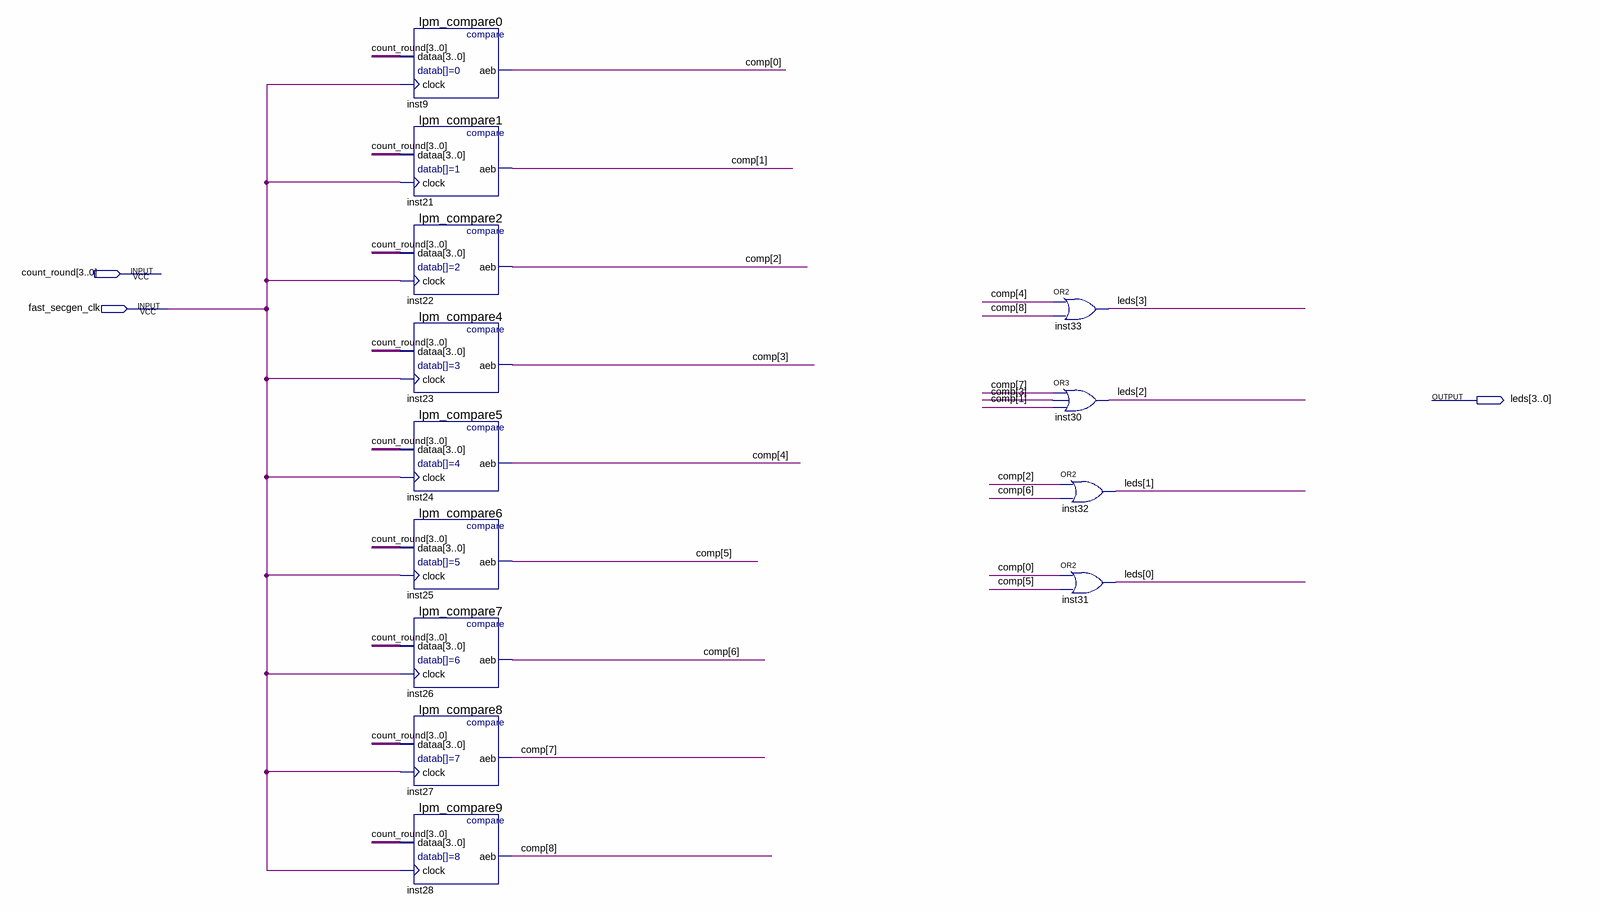
[diagram p0: schematic sheet]
// Quartus schematic leds_output.bdf as structural Verilog: 13 symbols, 3 pins
module leds_output (
  input  [3:0] count_round,
  input  fast_secgen_clk,
  output [3:0] leds
);

  wire [8:0] comp;

  lpm_compare0 inst9 (.dataa(count_round), .clock(fast_secgen_clk), .aeb(comp[0]));
  lpm_compare1 inst21 (.dataa(count_round), .clock(fast_secgen_clk), .aeb(comp[1]));
  lpm_compare2 inst22 (.dataa(count_round), .clock(fast_secgen_clk), .aeb(comp[2]));
  lpm_compare4 inst23 (.dataa(count_round), .clock(fast_secgen_clk), .aeb(comp[3]));
  lpm_compare5 inst24 (.dataa(count_round), .clock(fast_secgen_clk), .aeb(comp[4]));
  lpm_compare6 inst25 (.dataa(count_round), .clock(fast_secgen_clk), .aeb(comp[5]));
  lpm_compare7 inst26 (.dataa(count_round), .clock(fast_secgen_clk), .aeb(comp[6]));
  lpm_compare8 inst27 (.dataa(count_round), .clock(fast_secgen_clk), .aeb(comp[7]));
  lpm_compare9 inst28 (.dataa(count_round), .clock(fast_secgen_clk), .aeb(comp[8]));
  or inst33 (leds[3], comp[4], comp[8]);
  or inst30 (leds[2], comp[7], comp[3], comp[1]);
  or inst32 (leds[1], comp[2], comp[6]);
  or inst31 (leds[0], comp[0], comp[5]);
endmodule
